# Altium project LAB1.PrjPcb
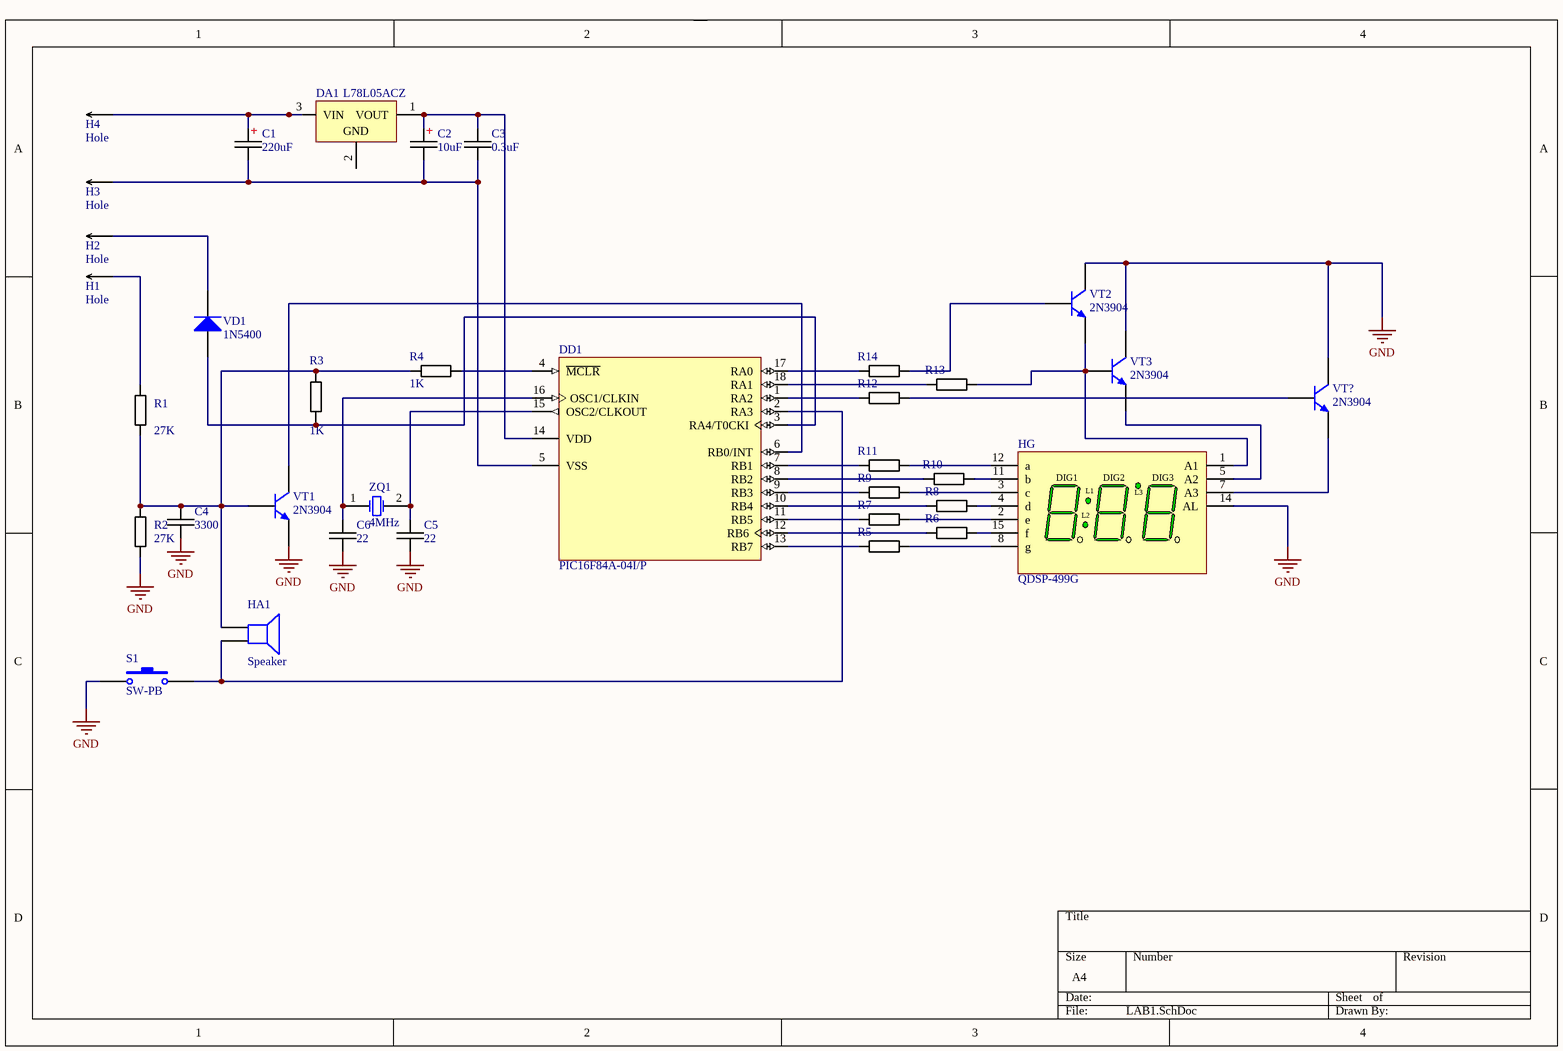
[diagram p0: LAB1.SchDoc]
1 sheet, 35 parts. Net scope: global (net labels, ports and power ports of the same name join across sheets).
Board file: LAB1.PcbDoc

## Sheet LAB1.SchDoc
size A4; SheetNumber: 1; SheetTotal: 1

### Parts
C1  220uF  [CAP AL 470/25]
C2  10uF  [CAP AL 470/25]
C3  0.3uF  [CAPACITOR 1206]
C4  3300  [CAPACITOR 1206]
C5  22  [CAPACITOR 1206]
C6  22  [CAPACITOR 1206]
DA1  L78L05ACZ  [TO-92]
DD1  PIC16F84A-04I/P  [PDIP300-P18]
H1  Hole  [Hole 2.5]
H2  Hole  [Hole 2.5]
H3  Hole  [Hole 2.5]
H4  Hole  [Hole 2.5]
HA1  Speaker  [PIN2]
HG  QDSP-499G  [QDSP-4]
R1  27K  [Resistor 1206]
R2  27K  [Resistor 1206]
R3  1K  [Resistor 1206]
R4  1K  [Resistor 1206]
R5  1K  [Resistor 1206]  (value not drawn)
R6  1K  [Resistor 1206]  (value not drawn)
R7  1K  [Resistor 1206]  (value not drawn)
R8  1K  [Resistor 1206]  (value not drawn)
R9  1K  [Resistor 1206]  (value not drawn)
R10  1K  [Resistor 1206]  (value not drawn)
R11  1K  [Resistor 1206]  (value not drawn)
R12  1K  [Resistor 1206]  (value not drawn)
R13  1K  [Resistor 1206]  (value not drawn)
R14  1K  [Resistor 1206]  (value not drawn)
S1  SW-PB  [SPST-2]
VD1  1N5400  [DO-201AD]
VT1  2N3904  [TO-92A]
VT2  2N3904  [TO-92A]
VT3  2N3904  [TO-92A]
VT?  2N3904  [TO-92A]
ZQ1  4MHz  [HC49/4H_SMX]

### Nets
GND: C4.2 C5.2 C6.2 HG.14(AL) R2.2 S1.1 VT1.1(E) VT2.3(C) VT3.3(C) VT?.3(C)
NetC1_0: C1.0 C2.0 C3.2 DD1.5(VSS) H3.0
NetC1_1: C1.1 DA1.3(VIN) H4.0
NetC2_1: C2.1 C3.1 DA1.1(VOUT) DD1.14(VDD)
NetC4_1: C4.1 HA1.1 R1.2 R2.1 R3.1 R4.1 VT1.2(B)
NetC5_1: C5.1 DD1.15(OSC2/CLKOUT) ZQ1.2(OSC2)
NetC6_1: C6.1 DD1.16(OSC1/CLKIN) ZQ1.1(OSC1)
NetDD1_1: DD1.1(RA2) R12.1
NetDD1_2: DD1.2(RA3) HA1.2 S1.2
NetDD1_3: DD1.3(RA4/T0CKI) R3.2 VD1.1(A)
NetDD1_4: DD1.4(~{MCLR}) R4.2
NetDD1_6: DD1.6(RB0/INT) VT1.3(C)
NetDD1_7: DD1.7(RB1) R11.1
NetDD1_8: DD1.8(RB2) R10.1
NetDD1_9: DD1.9(RB3) R9.1
NetDD1_10: DD1.10(RB4) R8.1
NetDD1_11: DD1.11(RB5) R7.1
NetDD1_12: DD1.12(RB6) R6.1
NetDD1_13: DD1.13(RB7) R5.1
NetDD1_17: DD1.17(RA0) R14.1
NetDD1_18: DD1.18(RA1) R13.1
NetH1_0: H1.0 R1.1
NetH2_0: H2.0 VD1.2(K)
NetHG_1: HG.1(A1) R13.2 VT2.1(E) VT3.2(B)
NetHG_2: HG.2(e) R7.2
NetHG_3: HG.3(c) R9.2
NetHG_4: HG.4(d) R8.2
NetHG_5: HG.5(A2) VT3.1(E)
NetHG_7: HG.7(A3) VT?.1(E)
NetHG_8: HG.8(g) R5.2
NetHG_11: HG.11(b) R10.2
NetHG_12: HG.12(a) R11.2
NetHG_15: HG.15(f) R6.2
NetR12_2: R12.2 VT?.2(B)
NetR14_2: R14.2 VT2.2(B)

Not connected (* = marked no-connect by the designer): DA1 2(GND)

### Notes on the sheet
- (in symbol QDSP-499G) DIG1; DIG2; DIG3; L1; L3; L2

### Library data of the parts
C1 C2 = Capasitor polar: Value: *
C3-C6 = Capasitor: Value: *
DA1 = CMP-0244-00012-1: Positive Voltage Regulator, 5V, 3-Pin TO-92; ComponentLink2Description: Datasheet; ComponentLink1URL: http://www.st.com; ComponentLink2URL: http://www.st.com/internet/com/TECHNICAL_RESOURCES/TECHNICAL_LITERATURE/DATASHEET/CD00000446.pdf; PackageVersion: 2011; DatasheetVersion: 1/02/2011; PackageReference: TO-92; PackageDescription: TO, Flat Index; 3 In-Line, Axial Leads; Body Dia. 4.7mm; Lead Dia. 0.56 mm (max); ComponentLink1Description: Manufacturer URL
DD1 = CMP-0115-00205-1: Enhanced FLASH/EEPROM 8-Bit Microcontroller, 1K (x14-Bit words) FLASH, 68 Bytes RAM, 4 MHz, 18-Pin PDIP, Standard VDD Range, Industrial Temperature; PackageReference: PDIP300-P18; Code_JEDEC: MS-001; DatasheetVersion: revB, Aug-2001; PackageDescription: 18-Lead Plastic Dual In-Line (P) - 300 mil Body [PDIP]; PackageVersion: revBB, Aug-2009
HA1 = Speaker: Loudspeaker; Published: 24-Mar-1999; LatestRevisionDate: 17-Jul-2002; LatestRevisionNote: Re-released for DXP Platform.; PackageReference: PIN2; Publisher: Altium Limited
HG = QDSP-499G: 10 mm Gray Surface 7-Segment Display: 3-Digit with 2-Colons, CA, Slim Font, Untinted-Diffused without Pin 6 and No DP; LuminousIntensity: 3200 ucd (Minimum).; LED_Colour: Green; Note: No pins are present in positions 6, 9, 10 and 13.; Published: 26-May-2004; LatestRevisionDate: 11-Oct-2004; LatestRevisionNote: Display outline superimposed on PCB Footprint.; DatasheetDocument: 20-Nov-2001; PackageDocument: 20-Nov-2001; PackageReference: QDSP-4; Publisher: Altium Limited; ComponentLink1Description: Manufacturer Link; ComponentLink1URL: http://www.agilent.com/; ComponentLink2Description: Datasheet; ComponentLink2URL: http://cp.literature.agilent.com/litweb/pdf/5988-4824EN.pdf
R1-R14 = Resistor: Value: *
S1 = SW-PB: Switch; Published: 24-Mar-1999; LatestRevisionDate: 17-Jul-2002; LatestRevisionNote: Re-released for DXP Platform.; PackageReference: SPST-2; Publisher: Altium Limited; PackageDescription: Switch; 2 Leads
VD1 = 1N5400: 3.0 Ampere General Purpose Rectifier; Published: 8-Jun-2000; LatestRevisionDate: 17-Jul-2002; LatestRevisionNote: Re-released for DXP Platform.; DatasheetDocument: 1998; PackageDocument: Aug-1999; PackageReference: DO-201AD; Publisher: Altium Limited; ComponentLink1Description: Manufacturer Link; ComponentLink1URL: http://www.fairchildsemi.com/; ComponentLink2Description: Datasheet; ComponentLink2URL: http://www.fairchildsemi.com/ds/1N%2F1N5400.pdf
VT1-VT3 VT? = 2N3904: NPN General Purpose Amplifier; Published: 8-Jun-2000; LatestRevisionDate: 17-Jan-2003; LatestRevisionNote: PCB Footprint replaced; DatasheetVersion: 1997; PackageVersion: Sep-1998; PackageReference: TO-92A; Publisher: Altium Limited; PackageDescription: TO, Flat Index; 3 In-Line, Axial Leads; Body Dia. 4.5mm; Leads 0.51 x 0.48 mm (max); ComponentLink1Description: Manufacturer Link; ComponentLink1URL: http://www.fairchildsemi.com/; ComponentLink2Description: Datasheet; ComponentLink2URL: http://www.fairchildsemi.com/ds/2N%2F2N3904.pdf
ZQ1 = HC49/4H_SMX: Surface Mount Quartz Crystal; Note: PCB layout complies with manufacturer's recommendation.; Published: 17-Jul-2002; DatasheetDocument: 18-Oct-1999; PackageDocument: 18-Oct-1999; PackageReference: HC49/4H_SMX; Publisher: Altium Limited; ComponentLink1Description: Manufacturer Link; ComponentLink1URL: http://www.cmac.com/mt/; ComponentLink2Description: Datasheet; ComponentLink2URL: http://www.cmac.com/mt/databook/crystals/smd/hc49_4h_smx.pdf